# Altium project AC-Power-Monitor.PrjPcb
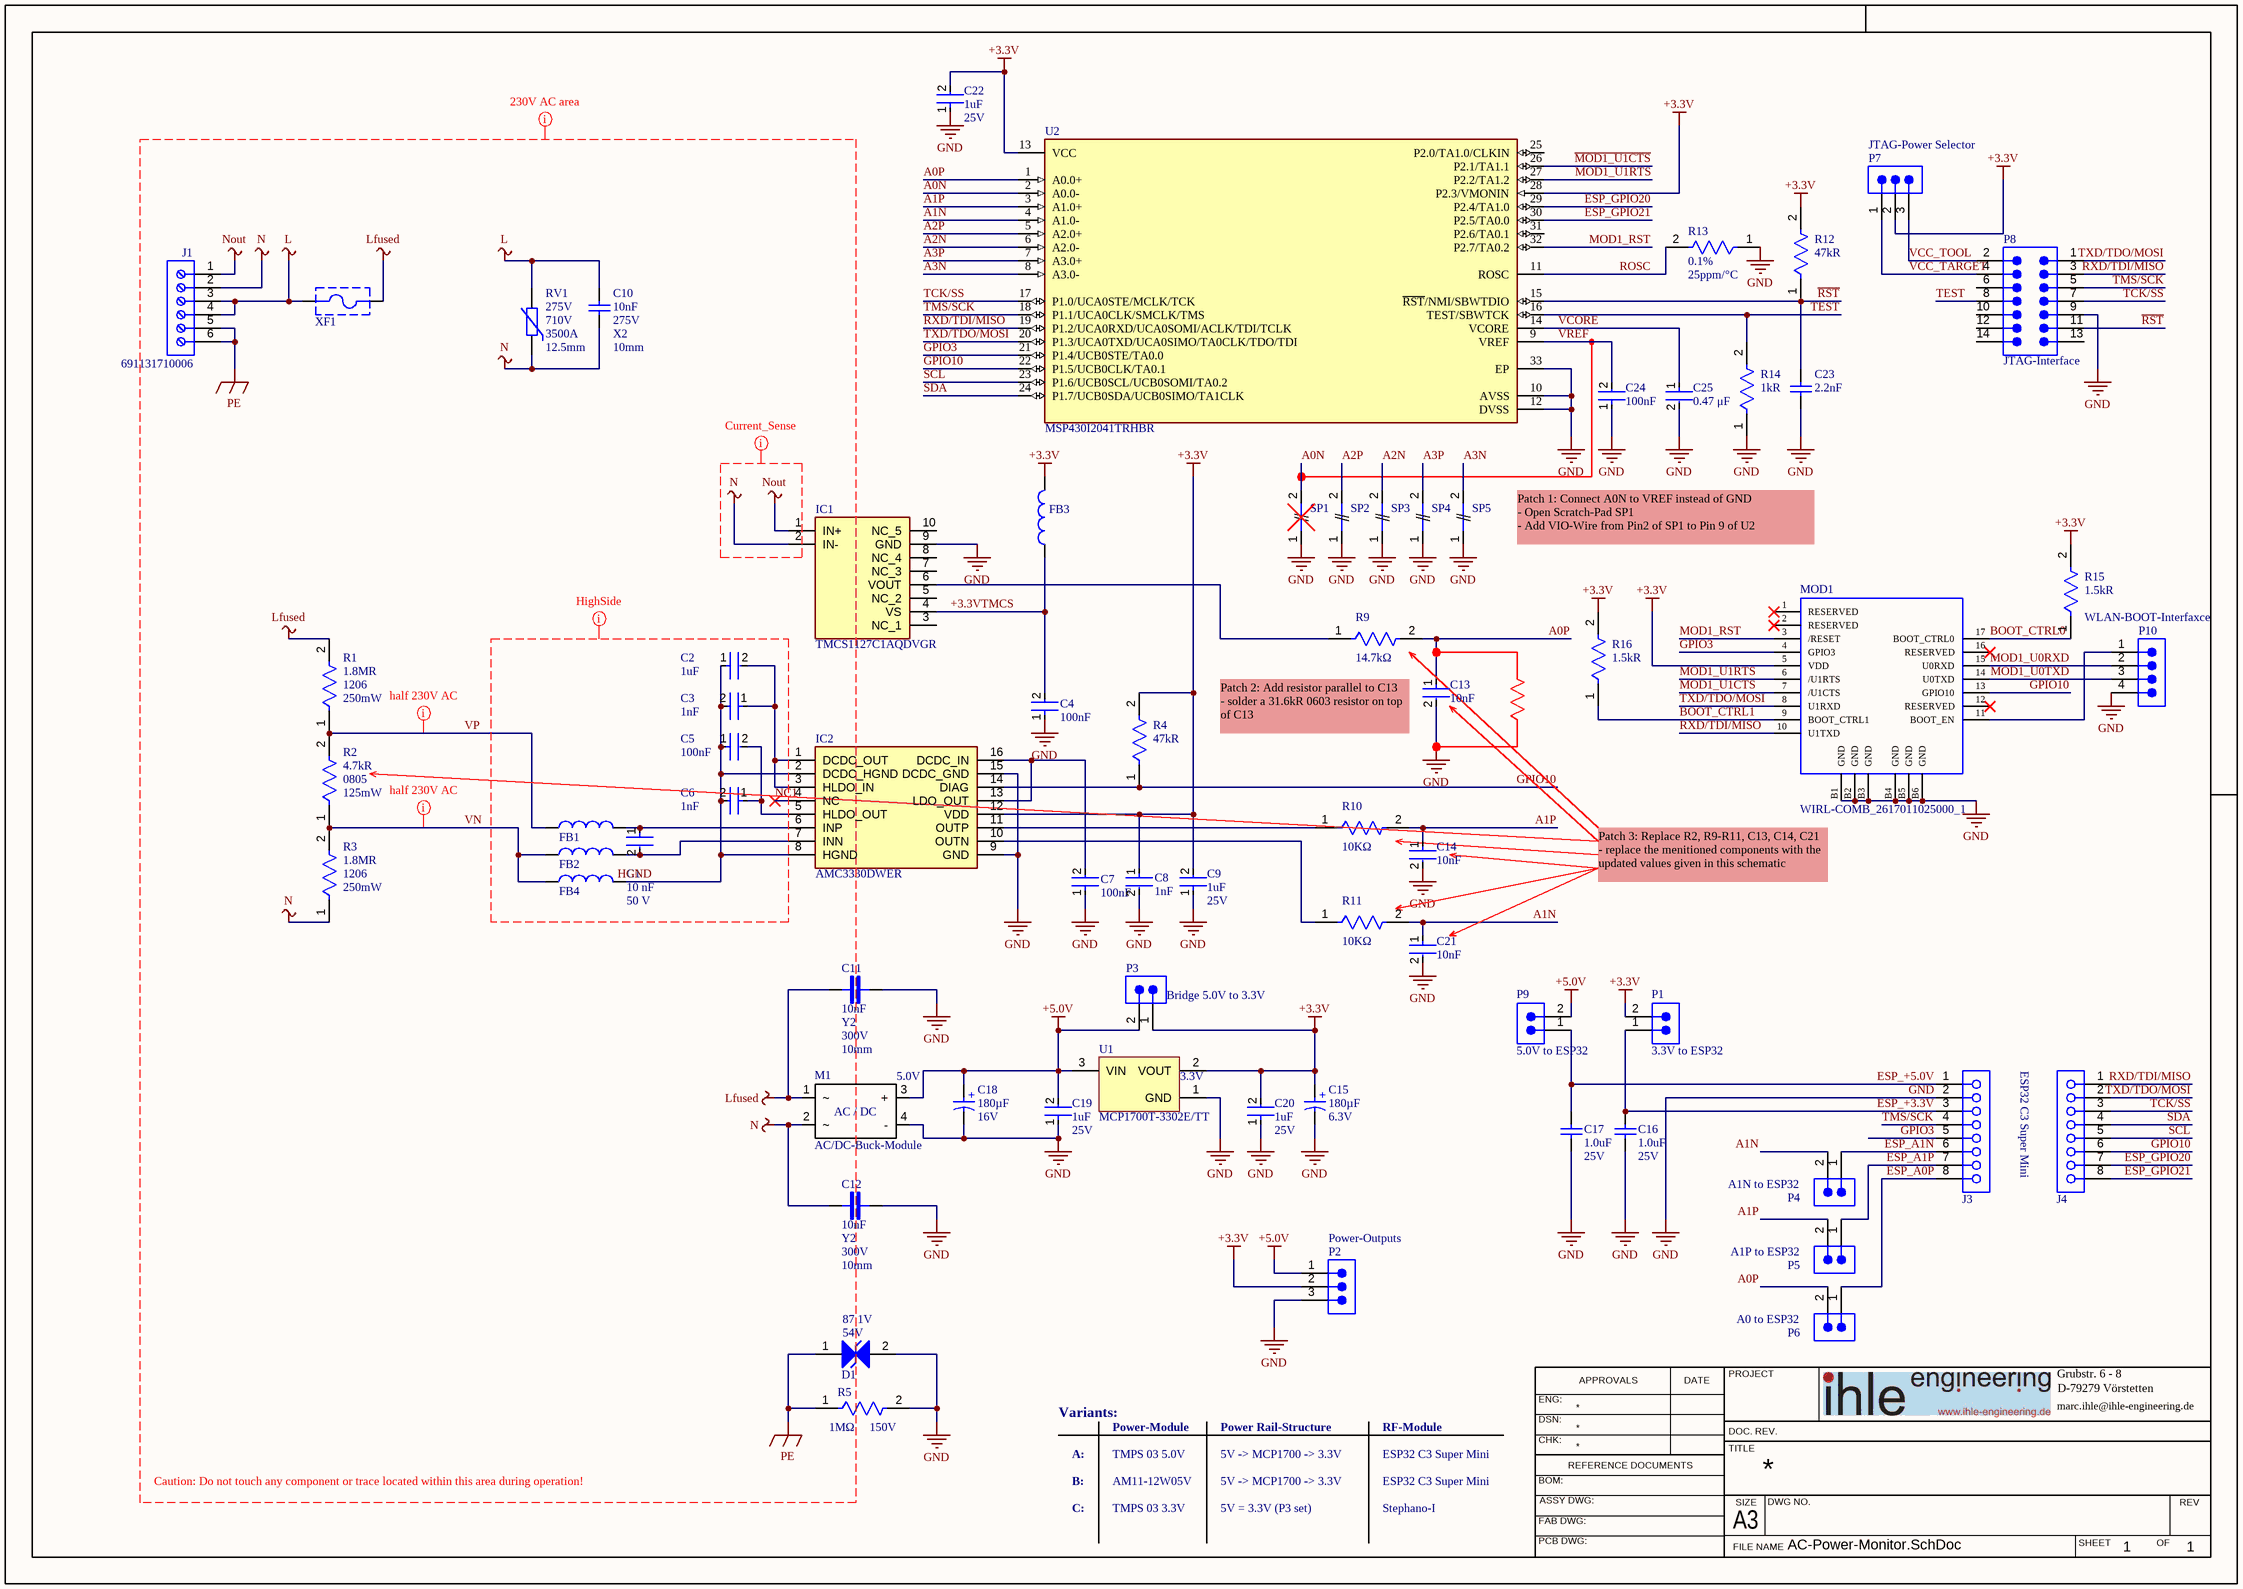
[diagram p0: AC-Power-Monitor.SchDoc]
1 sheet, 69 parts. Net scope: global (net labels, ports and power ports of the same name join across sheets).
Board file: AC-Power-Monitor.PcbDoc

## Sheet AC-Power-Monitor.SchDoc
size 420 x 297 mm; SheetNumber: 1; SheetTotal: 1; SPICEModelCacheGCRRSSDM: <root> / <DocumentId>GCRRSSDM</DocumentId> / <CacheFrame Number="0"> / <Model Name="0402_74269244182_1800ohm" Kind="CKT"> / <Text>******* / .subckt 0402_74269244182_1800ohm 1 2 / Rp 1 2 2726.742 / Cp 1 2 0.053399989p / Rs 1 N3 1.91 / L1 N3 2 3.050897u / .ends 0402_74269244182_1800ohm</Text> / </Model> / <Model Name="890324023006cs_10nf" Kind="CKT"> / <Text>******* / .subckt 890324023006CS_10nF 1 2 / Rser 1 3 0.135 / Lser 2 4 0.000000006652 / C1 3 4 0.00000001 / Rpar 3 4 30000000000 / .ends 890324023006CS_10nF</Text> / </Model> / <Model Name="875075155001_180uf" Kind="CKT"> / <Text>************************************************** / * Manufacturer:          Wurth Elektronik / * Kinds:                 Aluminum Polymer Capacitors / * Matchcode:             WCAP-PSLC / * Library Type:          LTspice / * Version:               rev22a / * Created/modified by:   Ella / * Date and Time:         6/1/2022 / * Team:                  eiSos EDA Service / * Contact:               libraries@we-online.com / ************************************************** / * Copyright(C) 2022 WÃ¼rth Elektronik eiSos GmbH &amp; Co. KG / * All Rights Reserved. / ************************************************** / * Disclaimer: While WÃ¼rth Elektronik eiSos has made every reasonable effort to ensure the accuracy / * of the simulation models provided, WÃ¼rth Elektronik eiSos does not guarantee the exemption of error on / * the simulation models, nor does WÃ¼rth Elektronik eiSos guarantee that the simulation model is current. / * WÃ¼rth Elektronik eiSos reserves the right to make any adjustments at any time without notice. / * WÃ¼rth Elektronik eiSos expressly disclaims all implied warranties regarding this simulation model. / ************************************************** / .subckt 875075155001_180uF 1 2 / Rser 1 3 0.0135478480891 / Lser 2 4 4.02110962E-09 / C1 3 4 0.00018 / Rpar 3 4 27777.7777777778 / .ends 875075155001_180uF</Text> / </Model> / <Model Name="875075355001_180uf" Kind="CKT"> / <Text>******* / .subckt 875075355001_180uF 1 2 / Rser 1 3 0.0104669984726 / Lser 2 4 3.95005494E-09 / C1 3 4 0.00018 / Rpar 3 4 27777.7777777778 / .ends 875075355001_180uF</Text> / </Model> / </CacheFrame> / </root>

### Parts
C1  value 10 nF  Voltage Rating: 50 V  [FP-CC0603-DA-MFG]  (hidden comment: CC0603KRX7R9BB103)
C2  Capacitance: 1uF  [FP-CGA3E-0_3-0_1-IPC_B]  (hidden comment: CGA3E1X7R1E105K080AC)
C3  Capacitance: 1nF  [FP-0603-L_1_6_0_15-W_0_81-IPC_B]  (hidden comment: 06035C102KAT2A)
C4  Capacitance: 100nF  [FP-CGA3E-0_3-0_1-IPC_A]  (hidden comment: CGA3E2X7R1H104K080AA)
C5  Capacitance: 100nF  [FP-CGA3E-0_3-0_1-IPC_C]  (hidden comment: CGA3E2X7R1H104K080AA)
C6  Capacitance: 1nF  [FP-0603-L_1_6_0_15-W_0_81-IPC_B]  (hidden comment: 06035C102KAT2A)
C7  Capacitance: 100nF  [FP-CGA3E-0_3-0_1-IPC_A]  (hidden comment: CGA3E2X7R1H104K080AA)
C8  Capacitance: 1nF  [FP-0603-L_1_6_0_15-W_0_81-IPC_A]  (hidden comment: 06035C102KAT2A)
C9  Capacitance: 1uF  Voltage Rating: 25V  [FP-CGA3E-0_3-0_1-IPC_A]  (hidden comment: CGA3E1X7R1E105K080AC)
C10  Pitch: 10mm  Rated Voltage (AC): 275V  Safty Class: X2  [WCAP-FTX2_L13W5H11_CS]  (hidden comment: 10nF)
C11  Capacitance: 10nF  Safty Class: Y2  Voltage (AC): 300V  Pitch: 10mm  [MKY22W2]  (hidden comment: MKY22W21003I00)
C12  Capacitance: 10nF  Safty Class: Y2  Voltage (AC): 300V  Pitch: 10mm  [MKY22W2]  (hidden comment: MKY22W21003I00)
C13  Capacitance: 10nF  [FP-0603-L_1_6_0_15-W_0_81-IPC_B]  (hidden comment: 06035C103KAT4A)
C14  Capacitance: 10nF  [FP-0603-L_1_6_0_15-W_0_81-IPC_B]  (hidden comment: 06035C103KAT4A)
C15  Rated Voltage (DC): 6.3V  [WCAP-PSLC_D8H11.7]  (hidden comment: 180µF)
C16  Capacitance: 1.0uF  Rated Voltage: 25V  [CAPC1608X87X35LL15T15]  (hidden comment: C0603C105K3RACTU)
C17  Capacitance: 1.0uF  Rated Voltage: 25V  [CAPC1608X87X35LL15T15]  (hidden comment: C0603C105K3RACTU)
C18  Rated Voltage (DC): 16V  [WCAP-PSLC_D8H11.7]  (hidden comment: 180µF)
C19  Capacitance: 1uF  Voltage Rating: 25V  [FP-CGA3E-0_3-0_1-IPC_A]  (hidden comment: CGA3E1X7R1E105K080AC)
C20  Capacitance: 1uF  Voltage Rating: 25V  [FP-CGA3E-0_3-0_1-IPC_A]  (hidden comment: CGA3E1X7R1E105K080AC)
C21  Capacitance: 10nF  [FP-0603-L_1_6_0_15-W_0_81-IPC_B]  (hidden comment: 06035C103KAT4A)
C22  Capacitance: 1uF  Voltage Rating: 25V  [FP-CGA3E-0_3-0_1-IPC_B]  (hidden comment: CGA3E1X7R1E105K080AC)
C23  Capacitance: 2.2nF  [WCAP-CSGP_0603_L1.6W0.8H0.8_Reflow]  (hidden comment: 885012206085)
C24  Capacitance: 100nF  [FP-CGA3E-0_3-0_1-IPC_B]  (hidden comment: CGA3E2X7R1H104K080AA)
C25  value 0.47 μF  [FP-C0603C-CF-IPC_B]  (hidden comment: C0603C474K4RACTU)
D1  Clamping Voltage: 87.1V  Operating Voltage (DC): 54V  [WE-TVSP_DO-214AC_Bidirectional]  (hidden comment: 400W, 54VDC)
FB1  1800Ohm  [WE-TMSB_0402_HF/HS/WB]  (value not drawn)
FB2  1800Ohm  [WE-TMSB_0402_HF/HS/WB]  (value not drawn)
FB3  1800Ohm  [WE-TMSB_0402_HF/HS/WB]  (value not drawn)
FB4  1800Ohm  [WE-TMSB_0402_HF/HS/WB]  (value not drawn)
IC1  TMCS1127C1AQDVGR  [TMCS1127C1AQDVGR]
IC2  AMC3330DWER  [SOIC127P1030X265-16N]
J1  691131710006  [691131710006]
J3  61300811821  [61300811821]  (value not drawn)
J4  61300811821  [61300811821]  (value not drawn)
M1  AC/DC-Buck-Module  Output Voltage: 5.0V  [TMPS 03]
MOD1  WIRL-COMB_2617011025000_1  [WE-FP-7]
P1  Purpose: 3.3V to ESP32  [61300211121]  (hidden comment: 61300211121)
P2  Purpose: Power-Outputs  [61300311121]  (hidden comment: 61300311121)
P3  Purpose: Bridge 5.0V to 3.3V  [61300211121]  (hidden comment: 61300211121)
P4  Purpose: A1N to ESP32  [61300211121]  (hidden comment: 61300211121)
P5  Purpose: A1P to ESP32  [61300211121]  (hidden comment: 61300211121)
P6  Purpose: A0 to ESP32  [61300211121]  (hidden comment: 61300211121)
P7  Purpose: JTAG-Power Selector  [61300311121]  (hidden comment: 61300311121)
P8  Purpose: JTAG-Interface  [61301421121]  (hidden comment: 61301421121)
P9  Purpose: 5.0V to ESP32  [61300211121]  (hidden comment: 61300211121)
P10  Purpose: WLAN-BOOT-Interfaxce  [61300411121]  (hidden comment: 61300411121)
R1  Power Rating: 250mW  Case/Package: 1206  Resistance: 1.8MR  [FP-RK73H2B-IPC_B]  (hidden comment: RK73H2BTTD1804F)
R2  Case/Package: 0805  Max Power Dissipation: 125mW  Resistance: 4.7kR  [FP-CRCW0805-e3-IPC_B]  (hidden comment: CRCW08054K70FKEA)
R3  Power Rating: 250mW  Case/Package: 1206  Resistance: 1.8MR  [FP-RK73H2B-IPC_B]  (hidden comment: RK73H2BTTD1804F)
R4  Resistance: 47kR  [FP-CRCW0603-e3-IPC_B]  (hidden comment: CRCW060347K0FKEA)
R5  value 1MΩ  Voltage Rating: 150V  [FP-CRGCQ0805-IPC_C]  (hidden comment: CRGCQ0805F1M0)
R9  value 14.7kΩ  [FP-ERA3A-IPC_B]  (hidden comment: ERA-3AEB1472V)
R10  value 10KΩ  [FP-RN731J-IPC_B]  (hidden comment: RN73C1J10KBTG)
R11  value 10KΩ  [FP-RN731J-IPC_B]  (hidden comment: RN73C1J10KBTG)
R12  Resistance: 47kR  [FP-KTR03-IPC_C]  (hidden comment: KTR03EZPF4702)
R13  Tolerance: 0.1%  Temperature Coefficient: 25ppm/°C  [FP-CPF0603-MFG]  (hidden comment: CPF0603B20KE1)
R14  Resistance: 1kR  [FP-AC0603-IPC_B]  (hidden comment: AC0603FR-071KL)
R15  Resistance: 1.5kR  [FP-CRCW0603-e3-IPC_A]  (hidden comment: CRCW06031K50FKEA)
R16  Resistance: 1.5kR  [FP-CRCW0603-e3-IPC_A]  (hidden comment: CRCW06031K50FKEA)
RV1  Diameter: 12.5mm  Clamping Voltage: 710V  Operating Voltage (AC): 275V  (Reverse) Peak Pulse Current: 3500A  [D12.5W6.5H16P1.3]  (hidden comment: 275VAC, 350VDC)
SP1  Scratch_NetTie  [Scratch_NetTie_0603]  (value not drawn)  (net tie, no BOM)
SP2  Scratch_NetTie  [Scratch_NetTie_0603]  (value not drawn)  (net tie, no BOM)
SP3  Scratch_NetTie  [Scratch_NetTie_0603]  (value not drawn)  (net tie, no BOM)
SP4  Scratch_NetTie  [Scratch_NetTie_0603]  (value not drawn)  (net tie, no BOM)
SP5  Scratch_NetTie  [Scratch_NetTie_0603]  (value not drawn)  (net tie, no BOM)
U1  MCP1700T-3302E/TT  Output Voltage: 3.3V  [SOT-23-TT3_L]
U2  MSP430I2041TRHBR  [FP-RHB0032M-MFG]
XF1  696106003002  [696106003002]  (value not drawn)

### Nets
+3.3V: C8.1 C9.2 C15.1(P) C20.2 C22.2 FB3.2 IC2.12(VDD) MOD1.5(VDD) P1.2 P2.2 P3.1 P7.2 R4.2 R12.2 R15.2 R16.2 U1.2(VOUT) U2.13(VCC) U2.28(P2.3/VMONIN)
+5.0V: C18.1(P) C19.2 M1.3(+) P2.1 P3.2 P9.2 U1.3(VIN)
GND: C4.1 C7.1 C8.2 C9.1 C11.2 C12.2 C13.2 C14.2 C15.2(N) C16.1 C17.1 C18.2(N) C19.1 C20.1 C21.2 C22.1 C23.1 C24.1 C25.2 D1.2 IC1.9(GND) IC2.9(GND) IC2.15(DCDC_GND) J3.2 M1.4(-) MOD1.B1(GND) MOD1.B2(GND) MOD1.B3(GND) MOD1.B4(GND) MOD1.B5(GND) MOD1.B6(GND) P2.3 P8.9 P10.4 R5.2 R13.1 R14.1 SP1.1 SP2.1 SP3.1 SP4.1 SP5.1 U1.1(GND) U2.10(AVSS) U2.12(DVSS) U2.33(EP)
L: C10.2 J1.3 J1.4 RV1.2 XF1.1
Lfused: C11.1 M1.1 R1.2 XF1.2
N: C10.1 C12.1 IC1.2(IN-) J1.2 M1.2 R3.1 RV1.1
Nout: IC1.1(IN+) J1.1
PE: D1.1 J1.5 J1.6 R5.1
+3.3VTMCS: C4.2 FB3.1 IC1.4(VS)
~{MOD1_U1CTS}: MOD1.7(/U1CTS) U2.26(P2.1/TA1.1)
~{MOD1_U1RTS}: MOD1.6(/U1RTS) U2.27(P2.2/TA1.2)
~{RST}: C23.2 P8.11 R12.1 U2.15(~{RST}/NMI/SBWTDIO)
A0N: SP1.2 U2.2(A0.0-)
A0P: C13.1 P6.2 R9.2 U2.1(A0.0+)
A1N: C21.1 P4.2 R11.2 U2.4(A1.0-)
A1P: C14.1 P5.2 R10.2 U2.3(A1.0+)
A2N: SP3.2 U2.6(A2.0-)
A2P: SP2.2 U2.5(A2.0+)
A3N: SP5.2 U2.8(A3.0-)
A3P: SP4.2 U2.7(A3.0+)
BOOT_CTRL0: MOD1.17(BOOT_CTRL0) R15.1
BOOT_CTRL1: MOD1.9(BOOT_CTRL1) R16.1
ESP_+3.3V: C16.2 J3.3 P1.1
ESP_+5.0V: C17.2 J3.1 P9.1
ESP_A0P: J3.8 P6.1
ESP_A1N: J3.6 P4.1
ESP_A1P: J3.7 P5.1
ESP_GPIO20: J4.7 U2.29(P2.4/TA1.0)
ESP_GPIO21: J4.8 U2.30(P2.5/TA0.0)
GPIO3: J3.5 MOD1.4(GPIO3) U2.21(P1.4/UCB0STE/TA0.0)
GPIO10: IC2.14(DIAG) J4.6 MOD1.13(GPIO10) R4.1 U2.22(P1.5/UCB0CLK/TA0.1)
HGND: C2.1 C3.2 C5.1 C6.2 FB4.2 IC2.2(DCDC_HGND) IC2.8(HGND)
MOD1_RST: MOD1.3(/RESET) U2.32(P2.7/TA0.2)
MOD1_U0RXD: MOD1.15(U0RXD) P10.2
MOD1_U0TXD: MOD1.14(U0TXD) P10.3
NC1: IC2.4(NC)
ROSC: R13.2 U2.11(ROSC)
RXD/TDI/MISO: J4.1 MOD1.10(U1TXD) P8.3 U2.19(P1.2/UCA0RXD/UCA0SOMI/ACLK/TDI/TCLK)
SCL: J4.5 U2.23(P1.6/UCB0SCL/UCB0SOMI/TA0.2)
SDA: J4.4 U2.24(P1.7/UCB0SDA/UCB0SIMO/TA1CLK)
TCK/SS: J4.3 P8.7 U2.17(P1.0/UCA0STE/MCLK/TCK)
TEST: P8.8 R14.2 U2.16(TEST/SBWTCK)
TMS/SCK: J3.4 P8.5 U2.18(P1.1/UCA0CLK/SMCLK/TMS)
TXD/TDO/MOSI: J4.2 MOD1.8(U1RXD) P8.1 U2.20(P1.3/UCA0TXD/UCA0SIMO/TA0CLK/TDO/TDI)
VCC_TARGET: P7.1 P8.4
VCC_TOOL: P7.3 P8.2
VCORE: C25.1 U2.14(VCORE)
VN: FB2.1 FB4.1 R2.1 R3.2
VP: FB1.1 R1.1 R2.2
VREF: C24.2 U2.9(VREF)
NetC1_1: C1.1 FB1.2 IC2.6(INP)
NetC1_2: C1.2 FB2.2 IC2.7(INN)
NetC2_2: C2.2 C3.1 IC2.1(DCDC_OUT) IC2.3(HLDO_IN)
NetC5_2: C5.2 C6.1 IC2.5(HLDO_OUT)
NetC7_2: C7.2 IC2.13(LDO_OUT) IC2.16(DCDC_IN)
NetIC1_6: IC1.6(VOUT) R9.1
NetIC2_10: IC2.10(OUTN) R11.1
NetIC2_11: IC2.11(OUTP) R10.1
NetMOD1_11: MOD1.11(BOOT_EN) P10.1

Not connected (* = marked no-connect by the designer): IC1 3(NC_1) 5(NC_2) 7(NC_3) 8(NC_4) 10(NC_5); MOD1 1(RESERVED)* 2(RESERVED)* 12(RESERVED)* 16(RESERVED)*; P8 6 10 12 13 14; U2 25(P2.0/TA1.0/CLKIN) 31(P2.6/TA0.1)

### Layout directives
net class 230V AC Net: HGND, L, Lfused, N, NC1, Nout, PE, VN, VP
net class HighSide: HGND, NC1
net class half 230V AC: VN, VP
net class Current_Sense: N, Nout

### Notes on the sheet
- Patch 1: Connect A0N to VREF instead of GND
  - Open Scratch-Pad SP1
  - Add VIO-Wire from Pin2 of SP1 to Pin 9 of U2
- Patch 2: Add resistor parallel to C13
  - solder a 31.6kR 0603 resistor on top of C13
- Patch 3: Replace R2, R9-R11, C13, C14, C21
  - replace the menitioned components with the updated values given in this schematic
- ESP32 C3 Super Mini
- Variants:
- A:
- Power-Module
- TMPS 03 5.0V
- Power Rail-Structure
- 5V -> MCP1700 -> 3.3V
- RF-Module
- Caution: Do not touch any component or trace located within this area during operation!
- B:
- C:
- AM11-12W05V
- TMPS 03 3.3V
- 5V = 3.3V (P3 set)
- Stephano-I
- ENG:
- APPROVALS
- DATE
- PROJECT
- Grubstr. 6 - 8
- marc.ihle@ihle-engineering.de
- D-79279 Vörstetten
- DSN:
- CHK:
- REFERENCE DOCUMENTS
- DOC. REV.
- TITLE
- BOM:
- FAB DWG:
- PCB DWG:
- ASSY DWG:
- A3
- FILE NAME
- SIZE
- DWG NO.
- SHEET
- OF
- REV
- (in symbol 875075155001) +
- (in symbol 875075355001) +
- (in symbol AC/DC-Buck-Module) AC / DC

### Library data of the parts
C1 = CMP-2100-03600-2: CAP CER 10000PF 50V X7R 0603; Manufacturer: YAGEO; Tolerance: 0.1; Material: Ceramic; Temperature Coefficient: 15%; Mouser Description: Multilayer Ceramic Capacitor, CC Series, 0.01 - F, - 10%, X7R, 50 V, 0603 [1608 Metric]; Digikey Description: CAP CER 10000PF 50V X7R 0603; Height: 0.9mm; Category: Cap; Temperature Characteristic: X7R; Footprint Url: http://www.yageo.com/exep/pages/download/literatures/UPY-C_GEN_24.pdf; Lead Free: Yes; Manufacturer Part Number: CC0603KRX7R9BB103; Temperature: -55°C to +125°C; Device Class L3: Ceramic Capacitors; ComponentLink2Description: Datasheet; Voltage: 50 V; Package: CC0603-DA; Octopart: https://octopart.com/cc0603krx7r9bb103-yageo-192938; Automotive: No; Temperature Range High: +125°C; Temperature Range Low: -55°C; RoHS: TRUE; Device Class L1: Passive Components; ComponentLink2URL: http://www.yageo.com/documents/recent/UPY-GPHC_X7R_6.3V-to-50V_18.pdf; Device Class L2: Capacitors; Capacitance: 10 nF
C2 C9 C19 C20 C22 = CMP-08246-001507-1: Cap Ceramic 1uF 25V X7R 10% Pad SMD 0603 +125°C Automotive T/R; Dielectric: X7R; Thickness: 0.035inch; Width: 0.031inch; Ratings: AEC-Q200; Case Code (Metric): 1608; REACH SVHC: No SVHC; Voltage: 25V; Composition: Ceramic; Min Operating Temperature: -55°C; Termination: SMD/SMT; Depth: 0.8mm; Max Operating Temperature: 125°C; Mount: Surface Mount; Weight: 7.1E-05oz; Package Quantity: 4000; Tolerance: 10%; Packaging: Tape and Reel; Lead Free: Lead Free; Case/Package: 0603; Length: 1.6mm; Height: 0.8mm; Case Code (Imperial): 0603; Voltage Rating (DC): 25V
  C2: Voltage Rating: 25V
C3 C6 C8 = CMP-2006-04378-2: General Purpose Ceramic Capacitor, 0603, 1nF, 10%, X7R, 15%, 50V; Case Code (Metric): 1608; Min Operating Temperature: -55°C; Weight: 7.1E-05oz; Series: -; RoHS Compliant: Yes; Radiation Hardening: No; Height: 0.9mm; Mount: Surface Mount; REACH SVHC: No SVHC; Lead Free: Lead Free; Depth: 0.81mm; Voltage: 50V; Number of Pins: 2; Voltage Rating: 50V; Max Operating Temperature: 125°C; Termination: SMD/SMT; Construction: Flat; Case Code (Imperial): 0603; Dielectric: X7R; Width: 0.032inch; Tolerance: 10%; Case/Package: 0603; Contact Plating: Tin; Packaging: Tape and Reel; Voltage Rating (DC): 50V; Dielectric Material: Ceramic; Package Quantity: 4000; Thickness: 0.035inch; Length: 1.6mm
C4 C5 C7 C24 = CMP-2000-07546-2: Cap Ceramic 100nF 50V X7R 10% Pad SMD 0603 +125°C Automotive T/R; Weight: 7.1E-05oz; Composition: Ceramic; Max Operating Temperature: 125°C; Termination: SMD/SMT; Dielectric: X7R; Length: 1.6mm; Package Quantity: 1; REACH SVHC: No SVHC; Lead Free: Lead Free; Case Code (Metric): 1608; Min Operating Temperature: -55°C; Packaging: Tape and Reel; Tolerance: 10%; Voltage Rating: 50V; Case Code (Imperial): 0603; Case/Package: 0603; Voltage Rating (DC): 50V; Depth: 0.8mm; Radiation Hardening: No; Ratings: AEC-Q200; Mount: Surface Mount; Voltage: 50V; Thickness: 0.035inch; Width: 0.8mm; Height: 0.8mm
C10 = 890324023006CS: WCAP-FTX2 Film Capacitor, THT, L13 x W5 x H11mm, 10nF, 275V; Manufacturer: Wurth Elektronik; Capacitance Tolerance: +/-10%; Dissipation Factor @1kHz: 0.1%; Dissipation Factor @100kHz: 0.5%; Insulation Resistance: 30GOhm; Rate of Voltage Rise: 500V/us; Technical Reference: MX2P010103K275ACPP56004; Manufacturer Part Number: 890324023006CS; Category: Film Capacitors; Match Code: WCAP-FTX2; ComponentLink1Description: Website Link; ComponentLink1URL: https://www.we-online.com/redexpert/article/890324023006CS?ad; ComponentLink2Description: Datasheet Link; ComponentLink2URL: https://www.we-online.com/redexpert/spec/890324023006CS?ad; Mount: Through Hole; Operating Temperature Max: 105°C; Operating Temperature Min: -40°C; Packaging: Carton; Length: 13mm; Width: 5mm; Height: 11mm; Capacitance: 10nF; Dissipation Factor @10kHz: 0.1%
C11 C12 = C_unipolar
C13 C14 C21 = CMP-2006-02076-2: CAP CER 10000PF 50V X7R 0603; Insulation Resistance: 100GR; Tolerance: 10%; Dissipation Factor: 2.5%; Number of Pins: 2; Package Quantity: 15000; Voltage Rating (DC): 50V; Case Code (Imperial): 0603; Series: -; Depth: 0.81mm; Termination: SMD/SMT; Packaging: Tape and Reel; Length: 1.6mm; Radiation Hardening: No; REACH SVHC: No SVHC; Height: 0.9mm; Min Operating Temperature: -55°C; Voltage Rating: 50V; RoHS Compliant: Yes; Case Code (Metric): 1608; Width: 0.81mm; Lead Free: Lead Free; Construction: Flat; Case/Package: 0603; Voltage: 50V; Dielectric: X7R; Max Operating Temperature: 125°C; Mount: Surface Mount
C15 = 875075155001: WCAP-PSLC Aluminum Polymer Capacitor, V-Chip SMT, D8 x H11.7mm, 180µF, 6.3V; Manufacturer: Wurth Elektronik; Capacitance Tolerance: +/-20%; Dissipation Factor: 8%; Endurance: 2000h; ESR: 8mΩ; Leakage Current: 226.8µA; Ripple Current: 5200mA; Technical Reference: PSEE117181M6R3DVCTFB000; Manufacturer Part Number: 875075155001; Category: Aluminum Polymer Capacitors; Match Code: WCAP-PSLC; ComponentLink1Description: Website Link; ComponentLink1URL: https://www.we-online.com/redexpert/article/875075155001?ad; ComponentLink2Description: Datasheet Link; ComponentLink2URL: https://www.we-online.com/redexpert/spec/875075155001?ad; Mount: Surface Mount; Operating Temperature Max: 105°C; Operating Temperature Min: -55°C; Packaging: Tape and Reel; Height: 11.7mm; Diameter: 8mm; Capacitance: 180µF
C16 C17 = CMP-2006-03713-1: Manufacturer: Kemet; Part Number: C0603C105K3RACTU
C18 = 875075355001: WCAP-PSLC Aluminum Polymer Capacitor, V-Chip SMT, D8 x H11.7mm, 180µF, 16V; Manufacturer: Wurth Elektronik; Capacitance Tolerance: +/-20%; Dissipation Factor: 8%; Endurance: 2000h; ESR: 10mΩ; Leakage Current: 576µA; Ripple Current: 4700mA; Technical Reference: PSEE117181M016DVCTFB000; Manufacturer Part Number: 875075355001; Category: Aluminum Polymer Capacitors; Match Code: WCAP-PSLC; ComponentLink1Description: Website Link; ComponentLink1URL: https://www.we-online.com/redexpert/article/875075355001?ad; ComponentLink2Description: Datasheet Link; ComponentLink2URL: https://www.we-online.com/redexpert/spec/875075355001?ad; Mount: Surface Mount; Operating Temperature Max: 105°C; Operating Temperature Min: -55°C; Packaging: Tape and Reel; Height: 11.7mm; Diameter: 8mm; Capacitance: 180µF
C23 = CMP-03913-53914794-1: 885012206085 Multilayer Ceramic Capacitor, Wcap-Csgp Series, 2200 Pf, 10%, X7R, 50 V, 0603 [1608 Metric] Rohs Compliant: Yes...; Voltage Rating (DC): 50V; Insulation Resistance: 10GΩ; Min Operating Temperature: -55°C; Voltage Rating: 50V; Dielectric: X7R; Mount: Surface Mount; Width: 800µm; REACH SVHC: Unknown; Case Code (Metric): 1608; NexarPartId: 53914794; Case Code (Imperial): 0603; Length: 1.6mm; RoHS: Compliant; Height: 800µm; Thickness: 939.8µm; Tolerance: 10%; Case/Package: 0603; Max Operating Temperature: 125°C; Packaging: Cut Tape (CT)
C25 = CMP-2006-03235-2: CAP CER 0.47UF 16V X7R 0603; Manufacturer: KEMET; Automotive Grade: Grade 1; Tolerance: 0.1; Temperature Coefficient: 30ppm/°C; Material: Ceramic; Device Class L3: Ceramic Capacitors; ComponentLink2URL: https://api.kemet.com/component-edge/download/datasheet/C0603C100J5GACAUTO.pdf; Height: 0.87mm; ComponentLink2Description: Datasheet; Device Class L2: Capacitors; Temperature Range Low: -55°C; Temperature Range High: +125°C; RoHS: TRUE; Mouser Description: 0603 C 470nF Ceramic Multilayer Capacitor, 16 V, +125degC, X7R Dielec, +/-10%; Temperature Characteristic: X7R; Manufacturer Part Number: C0603C474K4RACTU; Digikey Description: CAP CER 0.47UF 16V X7R 0603; Lead Free: Yes; Automotive: Yes; Octopart: https://octopart.com/c0603c474k4ractu-kemet-109683; Capacitance: 0.47 μF; Package: C0603C-CF; Voltage Rating: 16 V; Device Class L1: Passive Components; Category: Cap; Temperature: -55°C to +125°C
D1 = 824501541: WE-TVSP SMT Power TVS Diode, DO-214AC, Bidirectional, 400W, 54VDC; Manufacturer: Wurth Elektronik; (Reverse) Breakdown Voltage: 63.15V; (Reverse) Peak Pulse Current: 4.6A; ComponentLink1Description: Website Link; ComponentLink1URL: https://www.we-online.com/redexpert/article/824501541?ad; ComponentLink2Description: Datasheet Link; ComponentLink2URL: https://www.we-online.com/redexpert/spec/824501541?ad; Manufacturer Part Number: 824501541; Category: Surge Protection; Match Code: WE-TVSP; Mount: Surface Mount; Operating Temperature Max: 150°C; Operating Temperature Min: -65°C; Packaging: Tape and Reel; Case/Size Code: DO-214AC; Length: 4.24mm; Width: 2.67mm; Height: 2.25mm; Polarity: Bidirectional; Power Dissipation: 400W
FB1-FB4 = 74269244182: WE-TMSB Tiny Multilayer Suppression Bead, size 0402, 1800Ohm, 0.21A; Manufacturer: Wurth Elektronik; Case/Size Code: 0402; DC Resistance: 1910mOhm; Impedance @1GHz: 1500Ohm; Impedance Max: 2700Ohm; Impedance Max Test Condition: 450MHz; Type: High Frequency; Manufacturer Part Number: 74269244182; Category: Ferrites for PCB Assembly; Match Code: WE-TMSB; ComponentLink1Description: Website Link; ComponentLink1URL: https://www.we-online.com/redexpert/article/74269244182?ad; ComponentLink2Description: Datasheet Link; ComponentLink2URL: https://www.we-online.com/redexpert/spec/74269244182?ad; Mount: Surface Mount; Operating Temperature Max: 125°C; Operating Temperature Min: -55°C; Packaging: Tape and Reel; Length: 1mm; Width: 0.5mm; Height: 0.5mm; Impedance @100MHz: 1800Ohm; Rated Current: 0.21A
IC1 = TMCS1127C1AQDVGR: Integrated Circuit; Manufacturer_Name: Texas Instruments; Datasheet Link: https://www.ti.com/lit/ds/symlink/tmcs1127.pdf?ts=1735303481537&ref_url=https%253A%252F%252Fwww.ti.com%252Fproduct%252FTMCS1127%252Fpart-details%252FTMCS1127C1AQDVGR; Height: 2.65mm; Manufacturer_Part_Number: TMCS1127C1AQDVGR; Arrow Part Number: TMCS1127C1AQDVGR; Arrow Price/Stock: https://www.arrow.com/en/products/tmcs1127c1aqdvgr/texas-instruments?region=nac
IC2 = AMC3330DWER: Integrated Circuit; Manufacturer_Name: Texas Instruments; Datasheet Link: https://www.ti.com/lit/ds/symlink/amc3330.pdf?ts=1627904955935&ref_url=https%253A%252F%252Fwww.ti.com%252Fproduct%252FAMC3330; Height: 2.65mm; Manufacturer_Part_Number: AMC3330DWER; Mouser Part Number: 595-AMC3330DWER; Mouser Price/Stock: https://www.mouser.co.uk/ProductDetail/Texas-Instruments/AMC3330DWER?qs=zW32dvEIR3u5qLqnY17MoA%3D%3D; Arrow Part Number: AMC3330DWER; Arrow Price/Stock: https://www.arrow.com/en/products/amc3330dwer/texas-instruments?utm_currency=USD&region=nac
J1 = 691131710006: WR-TBL Series 1317 Horizontal Entry, THT, pitch 5mm, 06p; Manufacturer: Wurth Elektronik; Modularity: No; Rated Current: 16A; System: Wire Protector; Working Voltage: 300V; Manufacturer Part Number: 691131710006; Category: Terminal Block; Match Code: WR-TBL; ComponentLink1Description: Website Link; ComponentLink1URL: https://www.we-online.com/redexpert/article/691131710006?ad; ComponentLink2Description: Datasheet Link; ComponentLink2URL: https://www.we-online.com/redexpert/spec/691131710006?ad; Mount: Through Hole; Min Operating Temperature: -30°C; Max Operating Temperature: 120°C; Packaging: Box; Application: Pressure Clamp Divisible; Number of Pins: 6; Number of Rows: 1; Orientation: Horizontal; Pitch: 5mm
J3 J4 = 61300811821: WR-PHD Socket Header, THT, Vertical, pitch 2.54mm, 1 Row, 8P; Manufacturer: Wurth Elektronik; Contact Resistance: 20mOhm; Rated Current: 3A; Working Voltage: 250V; Withstanding Voltage: 500V; Manufacturer Part Number: 61300811821; Category: Board-to-Board Connectors; Match Code: WR-PHD; ComponentLink1Description: Website Link; ComponentLink1URL: https://www.we-online.com/redexpert/article/61300811821?ad; ComponentLink2Description: Datasheet Link; ComponentLink2URL: https://www.we-online.com/redexpert/spec/61300811821?ad; Mount: Through Hole; Operating Temperature Max: 125°C; Operating Temperature Min: -40°C; Packaging: Tray; Gender: Socket Header; Number of Pins: 8; Number of Rows: 1; Orientation: Vertical; Pitch: 2.54mm
MOD1 = WIRL-COMB_2617011025000_1: Stephano-I - Combined 2.4 GHz Wi-Fi and Bluetooth® LE 5.0 Module; RX sensitivity e.r.p.: -98 dBm; Line of Sight Range: 600; Frequency: 2402-2480MHz; Output Power e.r.p.: 4 dBm; Operating Supply Voltage max.: 3.6 V; Operating Supply Voltage min.: 3 V; RF Bitrate max.: 2 Mbps; ComponentLink1Description: Manufacturer; ComponentLink1URL: http://www.we-online.de; ComponentLink2Description: Datasheet; ComponentLink2URL: https://katalog.we-online.de/wco/datasheet/2617011025000.pdf; Part Number: 2617011025000; Published Date: October 2023; Publisher: Wurth Elektronik; Operating Temperature: -40 to +85degC; Mounting Technology: SMT; Packaging: Tape and Reel
P1 P3-P6 P9 = 61300211121: WR-PHD Pin Header, THT, Vertical, pitch 2.54mm, 1 Row, 2P; Manufacturer: Wurth Elektronik; Contact Resistance: 20mOhm; Rated Current: 3A; Working Voltage: 250V; Withstanding Voltage: 500V; Manufacturer Part Number: 61300211121; Category: Board-to-Board Connectors; Match Code: WR-PHD; ComponentLink1Description: Website Link; ComponentLink1URL: https://www.we-online.com/redexpert/article/61300211121?ad; ComponentLink2Description: Datasheet Link; ComponentLink2URL: https://www.we-online.com/redexpert/spec/61300211121?ad; Mount: Through Hole; Operating Temperature Max: 105°C; Operating Temperature Min: -40°C; Packaging: Bag; Gender: Pin Header; Number of Pins: 2; Number of Rows: 1; Orientation: Vertical; Pitch: 2.54mm
P2 P7 = 61300311121: WR-PHD Pin Header, THT, Vertical, pitch 2.54mm, 1 Row, 3P; Manufacturer: Wurth Elektronik; Contact Resistance: 20mOhm; Rated Current: 3A; Working Voltage: 250V; Withstanding Voltage: 500V; Manufacturer Part Number: 61300311121; Category: Board-to-Board Connectors; Match Code: WR-PHD; ComponentLink1Description: Website Link; ComponentLink1URL: https://www.we-online.com/redexpert/article/61300311121?ad; ComponentLink2Description: Datasheet Link; ComponentLink2URL: https://www.we-online.com/redexpert/spec/61300311121?ad; Mount: Through Hole; Operating Temperature Max: 105°C; Operating Temperature Min: -40°C; Packaging: Bag; Gender: Pin Header; Number of Pins: 3; Number of Rows: 1; Orientation: Vertical; Pitch: 2.54mm
P8 = 61301421121: WR-PHD Pin Header, THT, Vertical, pitch 2.54mm, 2 Row, 14P; Manufacturer: Wurth Elektronik; Contact Resistance: 20mOhm; Rated Current: 3A; Working Voltage: 250V; Withstanding Voltage: 500V; Manufacturer Part Number: 61301421121; Category: Board-to-Board Connectors; Match Code: WR-PHD; ComponentLink1Description: Website Link; ComponentLink1URL: https://www.we-online.com/redexpert/article/61301421121?ad; ComponentLink2Description: Datasheet Link; ComponentLink2URL: https://www.we-online.com/redexpert/spec/61301421121?ad; Mount: Through Hole; Operating Temperature Max: 105°C; Operating Temperature Min: -40°C; Packaging: Bag; Gender: Pin Header; Number of Pins: 14; Number of Rows: 2; Orientation: Vertical; Pitch: 2.54mm
P10 = 61300411121: WR-PHD Pin Header, THT, Vertical, pitch 2.54mm, 1 Row, 4P; Manufacturer: Wurth Elektronik; Contact Resistance: 20mOhm; Rated Current: 3A; Working Voltage: 250V; Withstanding Voltage: 500V; Manufacturer Part Number: 61300411121; Category: Board-to-Board Connectors; Match Code: WR-PHD; ComponentLink1Description: Website Link; ComponentLink1URL: https://www.we-online.com/redexpert/article/61300411121?ad; ComponentLink2Description: Datasheet Link; ComponentLink2URL: https://www.we-online.com/redexpert/spec/61300411121?ad; Mount: Through Hole; Operating Temperature Max: 105°C; Operating Temperature Min: -40°C; Packaging: Bag; Gender: Pin Header; Number of Pins: 4; Number of Rows: 1; Orientation: Vertical; Pitch: 2.54mm
R1 R3 = CMP-2003-01283-2: 1.8MΩ ±1% 0.25W Chip Resistor 1206 Thick Film AEC-Q200 Qualified; Voltage Rating: 200V; Temperature Coefficient: 200ppm/°C; Number of Pins: 2; RoHS Compliant: Yes; Series: RK73H; Resistance Tolerance: 1%; Case Code (Metric): 3216; Case Code (Imperial): 1206; Lead Free: Lead Free; Tolerance: 1%; Resistor Type: Thick Film
R2 = CMP-2100-03615-2: RES Thick Film, 4.7kΩ, 1%, 0.125W, 100ppm/°C, 0805; Voltage Rating: 150V; Termination: SMD/SMT; Weight: 0.000194oz; Number of Terminations: 2; Min Operating Temperature: -55°C; Case Code (Metric): 2012; Package Quantity: 10; Depth: 1.25mm; Military Standard: Not; Composition: Thick Film; Radiation Hardening: No; Contact Plating: Tin; Height: 0.45mm; Power Rating: 125mW; Features: Automotive AEC-Q200; Tolerance: 1%; Packaging: Tape and Reel; Max Operating Temperature: 155°C; Length: 2mm; Case Code (Imperial): 0805; Voltage Rating (DC): 150V; Width: 1.25mm; Temperature Coefficient: 100ppm/°C; Lead Free: Lead Free
R4 = CMP-2000-03379-3: RES SMD 47K OHM 1% 1/10W 0603; Voltage Rating: 75V; Max Power Dissipation: 100mW; Temperature Coefficient: 100ppm/°C; Size Code: 0603; Technology: THICK FILM; Case Code (Metric): 1608; Radiation Hardening: No; Case/Package: 0603; Number of Terminations: 2; Package Quantity: 5000; Width: 0.85mm; Series: CRCW; RoHS Compliant: Yes; Case Code (Imperial): 0603; Lead Free: Lead Free; Resistance Tolerance: 1%; Depth: 0.85mm; Contact Plating: Tin; Tolerance: 1%; Voltage Rating (DC): 75V; Min Operating Temperature: -55°C; Mount: Surface Mount; Packaging: Tape and Reel; Length: 1.55mm; Resistor Type: Thick Film; Features: Automotive AEC-Q200; Max Operating Temperature: 155°C; Weight: 7.1E-05oz; Construction: Rectangular; Height: 0.45mm; Military Standard: Not; Termination: SMD/SMT; Power Rating: 100mW
R5 = CMP-03211-002463-1: CRGCQ0805 1MΩ 0.125W ±100ppm/°C 1% 150V; Manufacturer: TE Connectivity; Tolerance: 0.01; RoHS: TRUE; Series: CRGCQ; Composition: Thick Film; Package: CRGCQ0805; ComponentLink2Description: Datasheet; Temperature Coefficient: ±100ppm/°C; Device Class L3: Chip SMD Resistors; Device Class L1: Passive Components; Power Rating: 0.125W; Temperature Range Low: -55°C; Device Class L2: Resistors; Ipc Land Pattern Name: RESC200125X55; Automotive Grade: Grade 1369; Ambient Temperature Range High: +70°C; Octopart: https://octopart.com/crgcq0805f1m0-te+connectivity-91018158; Manufacturer Part Number: CRGCQ0805F1M0; Lead Free: Yes; Temperature: -55°C to +155°C; Temperature Range High: +155°C; Resistance: 1MΩ; Height: 0.65mm; Automotive: Yes; Category: Res; ComponentLink2URL: https://www.te.com/commerce/DocumentDelivery/DDEController?Action=showdoc&DocId=Data+Sheet%7F1773204-3%7F1%7Fpdf%7FEnglish%7FENG_DS_1773204-3_1.pdf%7F4-2176341-1378
R9 = CMP-2000-00913-2: RES SMD 14.7KOHM 0.1% 1/10W 0603; Manufacturer: Panasonic Electronic Components; Description: 14.7 kOhms ±0.1% 0.1W, 1/10W Chip Resistor 0603 (1608 Metric) Automotive AEC-Q200 Thin Film; Automotive Grade: Grade 0; Voltage Rating: 75V; Power Rating: 0.1W; Temperature Coefficient: 25ppm/°C; Lead Free: Yes; Footprint Url: https://industrial.panasonic.com/cdbs/www-data/pdf/RDM0000/DMM0000COL17.pdf; Temperature Range High: +155°C; Octopart: https://octopart.com/era3aeb1472v-panasonic-42876006; Device Class L2: Resistors; Tolerance: 0.1%; Automotive: Yes; Package: ERA3A; ComponentLink2Description: Datasheet; Mouser Description: Res Thin Film 1.6 x 0.8 mm 14.7K Ohm 0.1% 0.1W(1/10W) 25ppm/ C Molded SMD Punched Carrier T/R; Category: Res; Device Class L1: Passive Components; Resistance: 14.7kΩ; Temperature: -55°C to +155°C; ComponentLink2URL: https://industrial.panasonic.com/cdbs/www-data/pdf/RDM0000/AOA0000C307.pdf; RoHS: TRUE; Composition: Metal Film; Temperature Range Low: -55°C; Series: ERA; Device Class L3: Chip SMD Resistors; Height: 0.55mm; Manufacturer Part Number: ERA-3AEB1472V; Digikey Description: RES SMD 14.7KOHM 0.1% 1/10W 0603
R10 R11 = CMP-03211-002042-1: Thin Film Resistors RN 0603 10KΩ 0.1% 10ppm/°C; Manufacturer: TE Connectivity; Power Rating: 0.063W; Voltage Rating: 50V; Temperature Range High: +155°C; Device Class L1: Passive Components; Package: RN731J; Temperature Range Low: -55°C; Lead Free: Yes; Height: 0.55mm; ComponentLink2URL: https://www.te.com/commerce/DocumentDelivery/DDEController?Action=showdoc&DocId=Data+Sheet%7F1773270%7FP%7Fpdf%7FEnglish%7FENG_DS_1773270_P.pdf%7F9-1614352-9; Composition: Thin Film; Tolerance: 0.1%; octopart_url: https://octopart.com/rn73c1j10kbtg-te+connectivity-21401008; packaging: 250 cut tape length; Device Class L2: Resistors; Temperature: -55°C to +155°C; Temperature Coefficient: 10ppm/°C; Ipc Land Pattern Name: RESC15580X45; Manufacturer Part Number: RN73C1J10KBTG; ComponentLink2Description: Datasheet; Category: Res; Automotive: No; Device Class L3: Chip SMD Resistors; Octopart: https://octopart.com/rn73c1j10kbtg-te+connectivity-21401008; Series: RN73; RoHS: TRUE; Resistance: 10KΩ
R12 = CMP-08839-030818-1: Res Thick Film 0603 47kΩ 1% 0.1W ±100ppm/°C Automotive Paper T/R; Max Power Dissipation: 100mW; Features: Automotive AEC-Q200; Height: 0.022inch; Package Quantity: 1; Case Code (Metric): 1608; Tolerance: 1%; Case/Package: 0603; Min Operating Temperature: -55°C; Number of Terminations: 2; Width: 0.031inch; Resistor Type: Thick Film; Packaging: Tape and Reel; Max Operating Temperature: 155°C; Length: 0.063inch; Case Code (Imperial): 0603; Temperature Coefficient: 100ppm/°C; Series: KTR
R13 = CMP-03211-006634-1: RES SMD 20KΩ 0.1% 1/16W 0603; Manufacturer: TE Connectivity; Voltage Rating: 50V; Power Rating: 0.063W; Value: 20KΩ; packaging: 1k Reel; ComponentLink2Description: Datasheet; Manufacturer Part Number: CPF0603B20KE1; Temperature: -55°C to +155°C; Temperature Range Low: -55°C; Device Class L1: Passive Components; ComponentLink2URL: https://www.te.com/commerce/DocumentDelivery/DDEController?Action=showdoc&DocId=Data+Sheet%7F1773200%7FM%7Fpdf%7FEnglish%7FENG_DS_1773200_M.pdf%7F3-1676481-2; octopart_url: https://octopart.com/cpf0603b20ke1-te+connectivity-22738773; Category: Res; Device Class L2: Resistors; Package: CPF0603; Height: 0.55mm; Resistance: 20KΩ; Device Class L3: Chip SMD Resistors; Composition: Thin Film; RoHS: TRUE; Automotive: No; Octopart: https://octopart.com/cpf0603b20ke1-te+connectivity-22738773; Temperature Range High: +155°C; Ipc Land Pattern Name: RESC15580X45; Series: CPF; Lead Free: Yes
R14 = CMP-2000-04828-3: RES 1kΩ 1.00% 0.1W 0603; Voltage Rating: 50V; Power Rating: 100mW; Tolerance: 1%; Temperature Coefficient: 100ppm/°C; Depth: 0.8mm; Case/Package: 0603; Size Code: 0603; Case Code (Metric): 1608; Height: 0.022inch; Series: AC; Width: 0.031inch; Construction: Rectangular; Length: 0.063inch; Case Code (Imperial): 0603; Package Quantity: 1; RoHS Compliant: Yes; Features: Moisture Resistant; Resistor Type: Thick Film; Max Power Dissipation: 100mW; Packaging: Tape and Reel; Termination: SMD/SMT; Ratings: AEC-Q200; Max Operating Temperature: 155°C; Min Operating Temperature: -55°C; Military Standard: Not; Lead Free: Lead Free; Number of Terminations: 2
R15 R16 = CMP-2000-02995-2: RES Thick Film, 1.5kΩ, 1%, 0.1W, 100ppm/°C, 0603; Working Voltage: 75V; Power Rating: 100mW; Max Operating Temperature: 155°C; Features: Automotive AEC-Q200; Min Operating Temperature: -55°C; Width: 0.033inch; Case/Package: 0603; Voltage Rating (DC): 75V; Termination: SMD/SMT; Mount: Surface Mount; Weight: 7.1E-05oz; Case Code (Metric): 1608; Height: 0.45mm; Voltage Rating: 75V; Length: 1.55mm; Package Quantity: 10; Lead Free: Lead Free; Composition: Thick Film; Packaging: Tape and Reel; Temperature Coefficient: 100ppm/°C; Tolerance: 1%; Military Standard: Not; Case Code (Imperial): 0603; Number of Terminations: 2; Max Power Dissipation: 100mW; Depth: 0.85mm; Contact Plating: Tin
RV1 = 820412711: WE-VD Disk Varistor, THT, 275VAC, 350VDC, 190pF; Manufacturer: Wurth Elektronik; Energy Absorption: 80J; Operating Voltage (DC): 350V; Pitch: 1.3mm; Power Dissipation: 0.4W; (Reverse) Breakdown Voltage: 430V; Manufacturer Part Number: 820412711; Category: Surge Protection; Match Code: WE-VD; ComponentLink1Description: Website Link; ComponentLink1URL: https://www.we-online.com/redexpert/article/820412711?ad; ComponentLink2Description: Datasheet Link; ComponentLink2URL: https://www.we-online.com/redexpert/spec/820412711?ad; Mount: Through Hole; Operating Temperature Max: 85°C; Operating Temperature Min: -40°C; Packaging: Tape and Reel; Width: 6.5mm; Height: 16mm; Channel Input Capacitance: 190pF
U1 = CMP-0136-00788-1: Low Quiescent Current LDO, 3-Pin SOT-23, Extended Temperature, Tape and Reel; Code_IPC: SOT23-3; DatasheetVersion: revB, Feb-2007; PackageDescription: 3-Lead Plastic Small Outline Transistor (TT) [SOT-23]; PackageVersion: revBB, Aug-2009; PackageReference: SOT-23-TT3
U2 = CMP-04869-000074-1: IC MCU 16BIT 32KB FLASH 32VQFN; Number of Timers/Counters: 2; Min Supply Voltage: 2.2V; Frequency: 16.384MHz; Data Bus Width: 16b; Number of I/Os: 16; RAM Size: 2KB; Oscillator Type: External; Interface: I2C; Number of ADC Channels: 4; Peripherals: Brown-out Detect/Reset; Number of UART Channels: 1; Core Architecture: MSP430; Max Supply Voltage: 3.6V; Watchdog Timer: Yes; Memory Type: FLASH; Case/Package: VQFN; Radiation Hardening: No; Package Quantity: 3000; Packaging: Tape and Reel; Number of Programmable I/O: 16; Mount: Surface Mount; Memory Size: 32KB; Number of Pins: 32; Max Operating Temperature: 105°C; Lead Free: Lead Free; Min Operating Temperature: -40°C; RoHS Compliant: Yes; Weight: 0.002547oz; Contact Plating: Gold; Max Frequency: 16.384MHz
XF1 = 696106003002: WR-FSH Fuseholder THT Blocks PCB Clip Cover; Manufacturer: Wurth Elektronik; Fuse Size: 5x20mm; Fuse: 1.5A (T); ComponentLink1Description: Website Link; ComponentLink1URL: https://www.we-online.com/redexpert/article/696106003002?ad; ComponentLink2Description: Datasheet Link; ComponentLink2URL: https://www.we-online.com/redexpert/spec/696106003002?ad; Manufacturer Part Number: 696106003002; Category: Fuse Holder; Match Code: WR-FSH; Mount: THT; Operating Temperature Max: 120°C; Operating Temperature Min: -30°C; Packaging: Box

## Assembly variants
A: not fitted C18 MOD1 U1
B: not fitted MOD1; alternate parts M1 -> AC/DC-Buck-Module
C: not fitted J3 J4 P4 P5 P6